# Altium schematic sheet P14 LED.SchDoc
size 297 x 209 mm
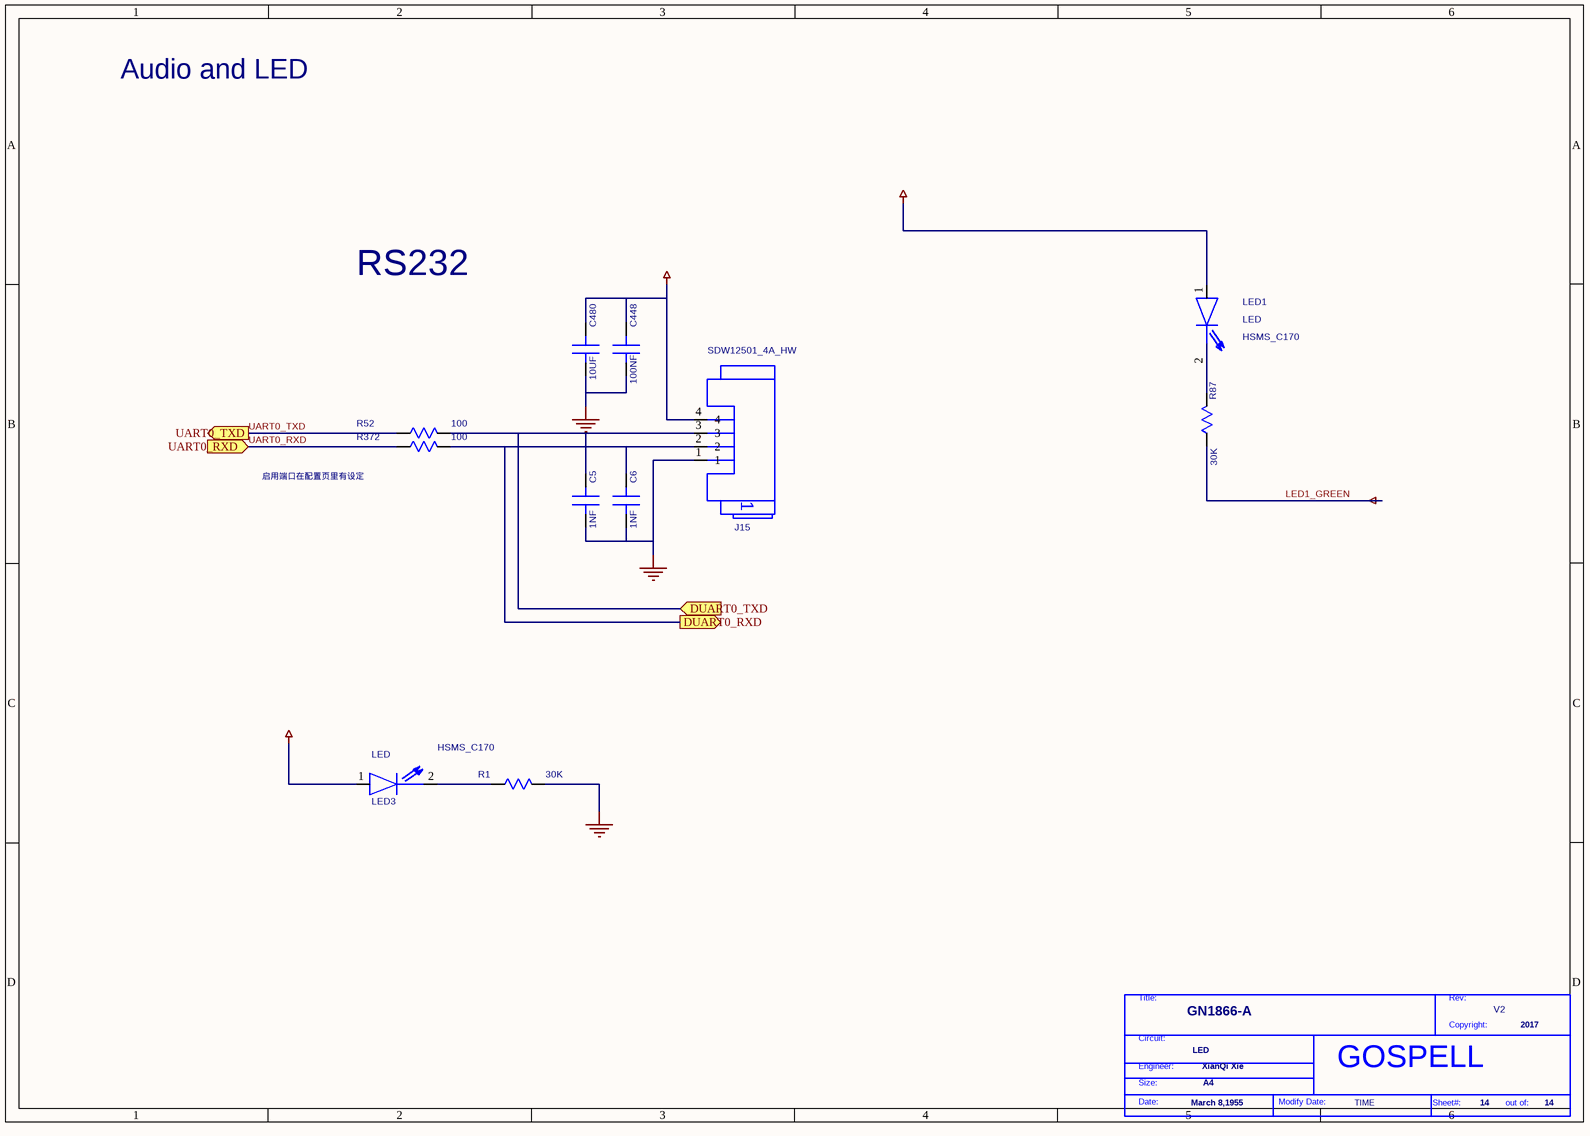
[diagram p0: P14 LED.SchDoc]

## Parts
*  Page Modify Date: TIME  Engineer: XianQi Xie  Copyright: 2017  Title: GN1866-A  RevCode: V2  Page Size: A4  Page Create Date: March 8,1955  Page Number: 14  Doc: LED  (hidden comment: GOSPELL)  (graphical)
C5  1NF  [SC0402]
C6  1NF  [SC0402]
C448  100NF  [SC0402]
C480  10UF  [SC0603]
J15  DEVICE: SDW12501_4A_HW  [4PIN-254]  (hidden comment: WBC1X41)
LED1  LED  DEVICE: HSMS_C170  [SD0805-LED]
LED3  LED  DEVICE: HSMS_C170  [SD0805-LED]
R1  30K  [SR0402]
R52  100  [SR0402]
R87  30K  [SR0402]
R372  100  [SR0402]

## Ports
DUART0_RXD (out), DUART0_TXD (in), UART0_RXD (in), UART0_TXD (out)

## Nets
3V3: C448.1(A) C480.1(A) J15.4 LED1.1(A) LED3.1(A)
GND: C5.2(B) C6.2(B) C448.2(B) C480.2(B) J15.1 R1.2(B)
LED1_GREEN: R87.1(A)
DUART0_RXD: C6.1(A) J15.2 R372.2(B) ; port DUART0_RXD
DUART0_TXD: C5.1(A) J15.3 R52.2(B) ; port DUART0_TXD
UART0_RXD: R372.1(A) ; port UART0_RXD
UART0_TXD: R52.1(A) ; port UART0_TXD
NetLED1_2: LED1.2(B) R87.2(B)
NetLED3_2: LED3.2(B) R1.1(A)

## Notes on the sheet
- Audio and LED
- RS232
- 启用端口在配置页里有设定
- (in symbol GOSPELL) Title:; Rev:; Copyright:; Circuit:; Engineer:; Size:; Date:; Modify Date:; Sheet#:; out of:

## Library data of the parts
C5 = C_0: PARTS: 1; PINSWAP: (A,B); LEVEL: STD; DEVICE: 04025C102KAT2A; OriginalSymbolOrigin: (0,30); CODE: 8070531; %195%%232%%202%%246%: SMD陶瓷电容-50V-1NF-+/-10%-X7R-0402-BT; %182%%238%%182%%168%%185%%164%%215%%247%%181%%231%%209%%185%(V): 50; COMPONENT_HIGH_MAX: 0.56MM; %208%%161%%192%%224%%195%%251%%179%%198%: SMD陶瓷电容; GVALUE: C  50V  1000pF +80%~-20%  X7R 0402; PKG_TYPE: SC0402
C6 = C_0: PARTS: 1; PINSWAP: (A,B); LEVEL: STD; DEVICE: 04025C102KAT2A; OriginalSymbolOrigin: (0,30); GVALUE: C  50V  1000pF +80%~-20%  X7R 0402; CODE: 8070531; %195%%232%%202%%246%: SMD陶瓷电容-50V-1NF-+/-10%-X7R-0402-BT; %182%%238%%182%%168%%185%%164%%215%%247%%181%%231%%209%%185%(V): 50; COMPONENT_HIGH_MAX: 0.56MM; %208%%161%%192%%224%%195%%251%%179%%198%: SMD陶瓷电容; PKG_TYPE: SC0402
C448 = C_0_Dup1: PARTS: 1; OriginalSymbolOrigin: (0,30); DEVICE: RMEMK105BJ104KV_FR; LEVEL: STD; PINSWAP: (A,B); CODE: 8070614; %195%%232%%202%%246%: SMD陶瓷电容-16V-100NF-+/-10%-X7R-0402-BT; %182%%238%%182%%168%%185%%164%%215%%247%%181%%231%%209%%185%(V): 16; COMPONENT_HIGH_MAX: 0.55MM; %208%%161%%192%%224%%195%%251%%179%%198%: SMD陶瓷电容; GVALUE: C 16V  0.1uF +80%~-20%  X7R 0402; PKG_TYPE: SC0402
C480 = C_0_Dup1: PARTS: 1; OriginalSymbolOrigin: (0,30); DEVICE: C1608X5R0J106MT0A0E; LEVEL: STD; PINSWAP: (A,B); GVALUE: C  6.3V  10uF +80%~-20%  X5R 0603; %208%%161%%192%%224%%195%%251%%179%%198%: SMD陶瓷电容; COMPONENT_HIGH_MAX: 0.9MM; %182%%238%%182%%168%%185%%164%%215%%247%%181%%231%%209%%185%(V): 6.3; %195%%232%%202%%246%: SMD陶瓷电容-6.3V-10000NF-+/-20%-X5R-0603-BT,TS16949; CODE: 8070649; PKG_TYPE: SC0603
J15 = WBC1X41_0: PARTS: 1; LEVEL: STD; PKG_TYPE: WBC0104-49T; CODE: 14100167; OriginalSymbolOrigin: (10,130); GVALUE: NC; %195%%232%%202%%246%: 普通插座-4PIN-单排-直式-1.25MM-2MM-THT-1A; COMPONENT_HIGH_MAX: 4.2MM; %208%%161%%192%%224%%195%%251%%179%%198%: 普通插座
LED1 = LED_1: PARTS: 1; OriginalSymbolOrigin: (10,20); CODE: 15020062; LEVEL: STD; GVALUE: SLED DIODE0805 绿色; %195%%232%%202%%246%: 发光二极管-0.015CD-红色/630NM-15MA-0805; COMPONENT_HIGH_MAX: 1.1MM; %208%%161%%192%%224%%195%%251%%179%%198%: 发光二极管; PKG_TYPE: SD0805-LED
LED3 = LED_1: PARTS: 1; OriginalSymbolOrigin: (10,20); CODE: 15020062; LEVEL: STD; GVALUE: SLED DIODE0805 绿色; %208%%161%%192%%224%%195%%251%%179%%198%: 发光二极管; COMPONENT_HIGH_MAX: 1.1MM; %195%%232%%202%%246%: 发光二极管-0.015CD-红色/630NM-15MA-0805; PKG_TYPE: SD0805-LED
R1 = R_0: PARTS: 1; OriginalSymbolOrigin: (10,20); PINSWAP: (A,B); DEVICE: RC0603JR_07510R; PKG_TYPE: SR0603; LEVEL: STD; GVALUE: R 1/16W 30K±5% 0402; %208%%161%%192%%224%%195%%251%%179%%198%: 片式厚膜电阻器; COMPONENT_HIGH_MAX: 0.55MM; %215%%232%%214%%181%%212%%202%%208%%237%%198%%171%%178%%238%: +/-5%; %182%%238%%182%%168%%185%%166%%194%%202%(W): 0.1; %195%%232%%202%%246%: 片式厚膜电阻器-0.1W-510OHM-+/-5%-0603; CODE: 7090638
R52 = R_1: PARTS: 1; OriginalSymbolOrigin: (10,20); PINSWAP: (A,B); DEVICE: RC0402FR_0733RL; LEVEL: STD; GVALUE: R 1/16W 100±5% 0402; CODE: 7090836; %195%%232%%202%%246%: 片式厚膜电阻器-0.0625W-33OHM-+/-1%-0402; %182%%238%%182%%168%%185%%166%%194%%202%(W): 0.06; %215%%232%%214%%181%%212%%202%%208%%237%%198%%171%%178%%238%: +/-1%; COMPONENT_HIGH_MAX: 0.4MM; %208%%161%%192%%224%%195%%251%%179%%198%: 片式厚膜电阻器; PKG_TYPE: SR0402
R87 = R_0: PARTS: 1; OriginalSymbolOrigin: (10,20); PINSWAP: (A,B); DEVICE: RK73B1ELTP472J; LEVEL: STD; GVALUE: R 1/16W 30K±5% 0402; %208%%161%%192%%224%%195%%251%%179%%198%: 片式厚膜电阻器; COMPONENT_HIGH_MAX: 0.4MM; %215%%232%%214%%181%%212%%202%%208%%237%%198%%171%%178%%238%: +/-5%; %182%%238%%182%%168%%185%%166%%194%%202%(W): 0.06; %195%%232%%202%%246%: 片式厚膜电阻器-0.0625W-4700OHM-+/-5%-0402-BT; CODE: 7090793; PKG_TYPE: SR0402
R372 = R_1: PARTS: 1; OriginalSymbolOrigin: (10,20); PINSWAP: (A,B); DEVICE: RC0402FR_0733RL; LEVEL: STD; GVALUE: R 1/16W 100±5% 0402; %208%%161%%192%%224%%195%%251%%179%%198%: 片式厚膜电阻器; COMPONENT_HIGH_MAX: 0.4MM; %215%%232%%214%%181%%212%%202%%208%%237%%198%%171%%178%%238%: +/-1%; %182%%238%%182%%168%%185%%166%%194%%202%(W): 0.06; %195%%232%%202%%246%: 片式厚膜电阻器-0.0625W-33OHM-+/-1%-0402; CODE: 7090836; PKG_TYPE: SR0402
* = GOSPELL: Page Count: 14; Cage Code: 2017